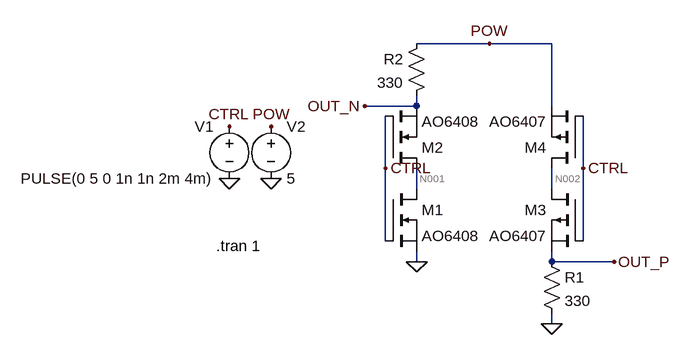
[diagram p0: schematic BacktoBack_FET_PoC.asc]
BacktoBack_FET_PoC.asc, the LTspice schematic file:
Version 4
SHEET 1 880 680
WIRE 224 -64 112 -64
WIRE 320 -64 224 -64
WIRE 112 32 112 16
WIRE 112 32 32 32
WIRE 320 32 320 -64
WIRE 64 128 64 48
WIRE 368 128 368 48
WIRE 112 160 112 128
WIRE 320 160 320 128
WIRE 64 240 64 128
WIRE 368 240 368 128
WIRE 112 272 112 256
WIRE 320 272 320 256
WIRE 416 272 320 272
WIRE 320 368 320 352
FLAG 112 272 0
FLAG 320 368 0
FLAG 64 128 CTRL
FLAG 368 128 CTRL
FLAG -176 64 CTRL
FLAG 224 -64 POW
FLAG -112 64 POW
FLAG -176 144 0
FLAG -112 144 0
FLAG 32 32 OUT_N
FLAG 416 272 OUT_P
SYMBOL nmos 64 160 R0
SYMATTR InstName M1
SYMATTR Value AO6408
SYMBOL nmos 64 128 M180
SYMATTR InstName M2
SYMATTR Value AO6408
SYMBOL pmos 368 160 M0
SYMATTR InstName M3
SYMATTR Value AO6407
SYMBOL pmos 368 128 R180
SYMATTR InstName M4
SYMATTR Value AO6407
SYMBOL res 304 256 R0
SYMATTR InstName R1
SYMATTR Value 330
SYMBOL res 128 -80 M0
SYMATTR InstName R2
SYMATTR Value 330
SYMBOL voltage -176 48 M0
WINDOW 123 0 0 Left 2
WINDOW 39 0 0 Left 2
SYMATTR InstName V1
SYMATTR Value PULSE(0 5 0 1n 1n 2m 4m)
SYMBOL voltage -112 48 R0
SYMATTR InstName V2
SYMATTR Value 5
TEXT -196 248 Left 2 !.tran 1

The netlist it stands for:
* BacktoBack_FET_PoC.asc
M1 N001 CTRL 0 0 AO6408
M2 N001 CTRL OUT_N OUT_N AO6408
M3 N002 CTRL OUT_P OUT_P AO6407
M4 N002 CTRL POW POW AO6407
R1 OUT_P 0 330
R2 POW OUT_N 330
V1 CTRL 0 PULSE(0 5 0 1n 1n 2m 4m)
V2 POW 0 5
.model NMOS NMOS
.model PMOS PMOS
.lib standard.mos
.tran 1
.backanno
.end

* Results of the author's LTspice run, read from the files saved beside the schematic
* Operating Point, zero values left out:
*   V(n001) = 4.914 V
*   V(out_n) = 5 V
*   V(n002) = 5 V
*   V(out_p) = 4.999 V
*   V(pow) = 5 V
*   Id(M4) = -15.15 mA
*   Is(M4) = 15.15 mA
*   Id(M3) = 15.15 mA
*   Is(M3) = -15.15 mA
*   Id(M2) = -973.4 pA
*   Is(M2) = 973.4 pA
*   Id(M1) = 968.3 pA
*   Is(M1) = -968.3 pA
*   I(R2) = 973.7 pA
*   I(R1) = 15.15 mA
*   I(V2) = -15.15 mA